# Altium schematic sheet Main.SchDoc
size A; SheetNumber: 1; SheetTotal: 1
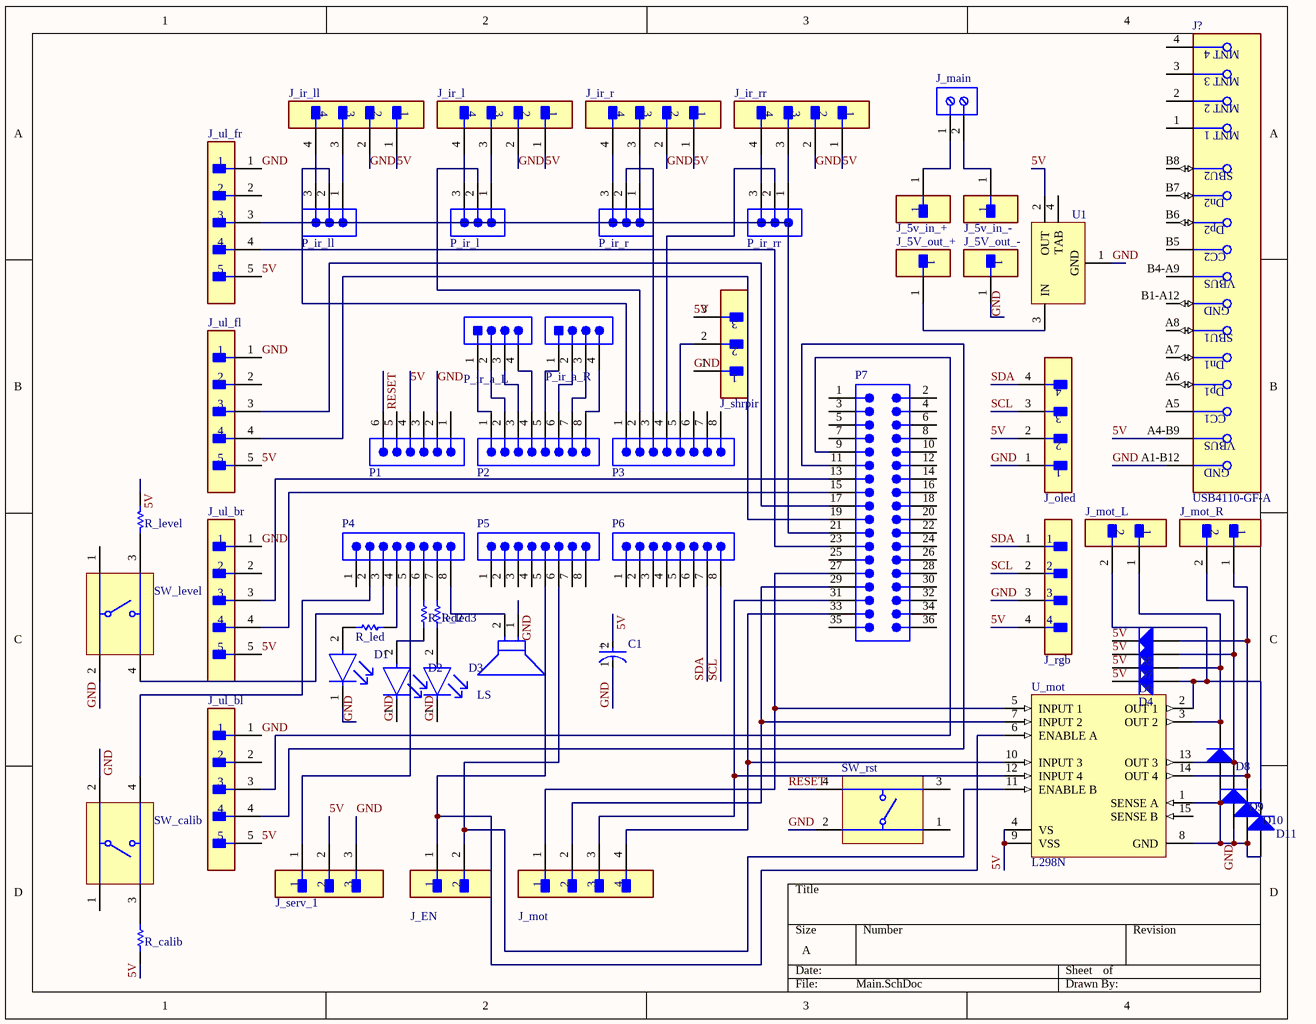
[diagram p0: Main.SchDoc]

## Parts
C1  EEEFT1H221AP  [FP-FTF-MFG]  (value not drawn)
D1  HSMG-C150  [FP-HSMG-C150-MFG]  (value not drawn)
D2  HSMG-C150  [FP-HSMG-C150-MFG]  (value not drawn)
D3  HSMG-C150  [FP-HSMG-C150-MFG]  (value not drawn)
D4  1N4148W-7-F  [DIOD-SOD123-2_V]  (value not drawn)
D5  1N4148W-7-F  [DIOD-SOD123-2_V]  (value not drawn)
D6  1N4148W-7-F  [DIOD-SOD123-2_V]  (value not drawn)
D7  1N4148W-7-F  [DIOD-SOD123-2_V]  (value not drawn)
D8  1N4148W-7-F  [DIOD-SOD123-2_V]  (value not drawn)
D9  1N4148W-7-F  [DIOD-SOD123-2_V]  (value not drawn)
D10  1N4148W-7-F  [DIOD-SOD123-2_V]  (value not drawn)
D11  1N4148W-7-F  [DIOD-SOD123-2_V]  (value not drawn)
J?  USB4110-GF-A  [FP-USB4110-GF-A-MFG]
J_5v_in_+  PBC01SAAN  [FP-PBC01SAAN-MFG]  (value not drawn)
J_5v_in_-  PBC01SAAN  [FP-PBC01SAAN-MFG]  (value not drawn)
J_5V_out_+  PBC01SAAN  [FP-PBC01SAAN-MFG]  (value not drawn)
J_5V_out_-  PBC01SAAN  [FP-PBC01SAAN-MFG]  (value not drawn)
J_EN  B2B-XH-A(LF)(SN)  [FP-B2B-XH-A_LF_SN-MFG]  (value not drawn)
J_ir_l  B4B-XH-A(LF)(SN)  [FP-B4B-XH-A_LF_SN-MFG]  (value not drawn)
J_ir_ll  B4B-XH-A(LF)(SN)  [FP-B4B-XH-A_LF_SN-MFG]  (value not drawn)
J_ir_r  B4B-XH-A(LF)(SN)  [FP-B4B-XH-A_LF_SN-MFG]  (value not drawn)
J_ir_rr  B4B-XH-A(LF)(SN)  [FP-B4B-XH-A_LF_SN-MFG]  (value not drawn)
J_main  1714955  [PHOE-1714955_V]  (value not drawn)
J_mot  B4B-XH-A(LF)(SN)  [FP-B4B-XH-A_LF_SN-MFG]  (value not drawn)
J_mot_L  B2B-XH-A(LF)(SN)  [FP-B2B-XH-A_LF_SN-MFG]  (value not drawn)
J_mot_R  B2B-XH-A(LF)(SN)  [FP-B2B-XH-A_LF_SN-MFG]  (value not drawn)
J_oled  B4B-XH-A(LF)(SN)  [FP-B4B-XH-A_LF_SN-MFG]  (value not drawn)
J_rgb  B4B-XH-A(LF)(SN)  [FP-B4B-XH-A_LF_SN-MFG]  (value not drawn)
J_serv_1  B3B-XH-A(LF)(SN)  [FP-B3B-XH-A_LF_SN-MFG]  (value not drawn)
J_shrpir  B3B-XH-A(LF)(SN)  [FP-B3B-XH-A_LF_SN-MFG]  (value not drawn)
J_ul_bl  B5B-EH-A(LF)(SN)  [FP-B5B-EH-A_LF_SN-MFG]  (value not drawn)
J_ul_br  B5B-EH-A(LF)(SN)  [FP-B5B-EH-A_LF_SN-MFG]  (value not drawn)
J_ul_fl  B5B-EH-A(LF)(SN)  [FP-B5B-EH-A_LF_SN-MFG]  (value not drawn)
J_ul_fr  B5B-EH-A(LF)(SN)  [FP-B5B-EH-A_LF_SN-MFG]  (value not drawn)
LS  SD1209T5-A1  [FP-SD1209-MFG]  (value not drawn)
P1  61300611121  [61300611121]  (value not drawn)
P2  61300811121  [61300811121]  (value not drawn)
P3  61300811121  [61300811121]  (value not drawn)
P4  61300811121  [61300811121]  (value not drawn)
P5  61300811121  [61300811121]  (value not drawn)
P6  61300811121  [61300811121]  (value not drawn)
P7  61303621121  [61303621121]  (value not drawn)
P_ir_a_L  S4B-XH-A(LF)(SN)  [JST-S4B-XH-A(LF)(SN)_V]  (value not drawn)
P_ir_a_R  S4B-XH-A(LF)(SN)  [JST-S4B-XH-A(LF)(SN)_V]  (value not drawn)
P_ir_l  61900311121  [61900311121]  (value not drawn)
P_ir_ll  61900311121  [61900311121]  (value not drawn)
P_ir_r  61900311121  [61900311121]  (value not drawn)
P_ir_rr  61900311121  [61900311121]  (value not drawn)
R_calib  ERJ-8GEY0R00V  [RESC3216X70X50NL05T20]  (value not drawn)
R_led  ERJ-8GEY0R00V  [RESC3216X70X50NL05T20]  (value not drawn)
R_led2  ERJ-8GEY0R00V  [RESC3216X70X50NL05T20]  (value not drawn)
R_led3  ERJ-8GEY0R00V  [RESC3216X70X50NL05T20]  (value not drawn)
R_level  ERJ-8GEY0R00V  [RESC3216X70X50NL05T20]  (value not drawn)
SW_calib  FSM4JSMA  [TECO-FSM4JSMA_V]  (value not drawn)
SW_level  FSM4JSMA  [TECO-FSM4JSMA_V]  (value not drawn)
SW_rst  FSM4JSMA  [TECO-FSM4JSMA_V]  (value not drawn)
U1  LM1117MPX-3.3/NOPB  [DCY0004A_L]  (value not drawn)
U_mot  L298N  [STM-FM-15]

## Nets
5V: C1.2(A) D4.2(K) D5.2(K) D6.2(K) D7.2(K) J?.A4-B9(VBUS) J_ir_l.1 J_ir_ll.1 J_ir_r.1 J_ir_rr.1 J_oled.2 J_rgb.4 J_serv_1.2 J_shrpir.3 J_ul_bl.5 J_ul_br.5 J_ul_fl.5 J_ul_fr.5 P1.4 R_calib.1 R_level.1 U1.2(OUT) U_mot.4(VS) U_mot.9(VSS)
GND: C1.1(C) D1.1(C) D2.1(C) D3.1(C) D8.1(A) D9.1(A) D10.1(A) D11.1(A) J?.A1-B12(GND) J_5V_out_-.1 J_ir_l.2 J_ir_ll.2 J_ir_r.2 J_ir_rr.2 J_oled.1 J_rgb.3 J_serv_1.3 J_shrpir.1 J_ul_bl.1 J_ul_br.1 J_ul_fl.1 J_ul_fr.1 LS.1(C) P1.2 SW_calib.2 SW_level.2 SW_rst.2 U1.1(GND) U_mot.1(SENSE_A) U_mot.8(GND)
RESET: P1.6 SW_rst.4
SCL: J_oled.3 J_rgb.2 P6.8
SDA: J_oled.4 J_rgb.1 P6.7
NetD1_2: D1.2(A) R_led.2
NetD2_2: D2.2(A) R_led2.2
NetD3_2: D3.2(A) R_led3.2
NetD4_1: D4.1(A) D11.2(K) J_mot_L.2 U_mot.2(OUT_1)
NetD5_1: D5.1(A) D10.2(K) J_mot_R.1 U_mot.14(OUT_4)
NetD6_1: D6.1(A) D8.2(K) J_mot_L.1 U_mot.3(OUT_2)
NetD7_1: D7.1(A) D9.2(K) J_mot_R.2 U_mot.13(OUT_3)
NetJ_5v_in_+_1: J_5v_in_+.1 J_main.1
NetJ_5v_in_-_1: J_5v_in_-.1 J_main.2
NetJ_5V_out_+_1: J_5V_out_+.1 U1.3(IN)
NetJ_EN_1: J_EN.1 P5.5 U_mot.6(ENABLE_A)
NetJ_EN_2: J_EN.2 P5.6 U_mot.11(ENABLE_B)
NetJ_ir_l_3: J_ir_l.3 P_ir_l.1
NetJ_ir_l_4: J_ir_l.4 P_ir_l.3
NetJ_ir_ll_3: J_ir_ll.3 P_ir_ll.1
NetJ_ir_ll_4: J_ir_ll.4 P_ir_ll.3
NetJ_ir_r_3: J_ir_r.3 P_ir_r.1
NetJ_ir_r_4: J_ir_r.4 P_ir_r.3
NetJ_ir_rr_3: J_ir_rr.3 P_ir_rr.1
NetJ_ir_rr_4: J_ir_rr.4 P_ir_rr.3
NetJ_mot_1: J_mot.1 P7.27 U_mot.5(INPUT_1)
NetJ_mot_2: J_mot.2 P7.29 U_mot.7(INPUT_2)
NetJ_mot_3: J_mot.3 P7.31 U_mot.12(INPUT_4)
NetJ_mot_4: J_mot.4 P7.33 U_mot.10(INPUT_3)
NetJ_serv_1_1: J_serv_1.1 P4.5
NetJ_shrpir_2: J_shrpir.2 P3.5
NetJ_ul_bl_3: J_ul_bl.3 P7.9
NetJ_ul_bl_4: J_ul_bl.4 P7.11
NetJ_ul_br_3: J_ul_br.3 P7.13
NetJ_ul_br_4: J_ul_br.4 P7.15
NetJ_ul_fl_3: J_ul_fl.3 P7.17
NetJ_ul_fl_4: J_ul_fl.4 P7.19
NetJ_ul_fr_3: J_ul_fr.3 P7.21
NetJ_ul_fr_4: J_ul_fr.4 P7.23
NetLS_2: LS.2(A) P4.8
NetP2_1: P2.1 P_ir_a_L.1
NetP2_2: P2.2 P_ir_a_L.2
NetP2_3: P2.3 P_ir_a_L.3
NetP2_4: P2.4 P_ir_a_L.4
NetP2_5: P2.5 P_ir_a_R.1
NetP2_6: P2.6 P_ir_a_R.2
NetP2_7: P2.7 P_ir_a_R.3
NetP2_8: P2.8 P_ir_a_R.4
NetP3_1: P3.1 P_ir_ll.2
NetP3_2: P3.2 P_ir_l.2
NetP3_3: P3.3 P_ir_r.2
NetP3_4: P3.4 P_ir_rr.2
NetP4_2: P4.2 SW_calib.4
NetP4_3: P4.3 SW_level.4
NetP4_4: P4.4 R_led.1
NetP4_6: P4.6 R_led2.1
NetP4_7: P4.7 R_led3.1
NetR_calib_2: R_calib.2 SW_calib.3
NetR_level_2: R_level.2 SW_level.3

Not connected (* = marked no-connect by the designer): J? 1(MNT_1) 2(MNT_2) 3(MNT_3) 4(MNT_4) A5(CC1) A6(Dp1) A7(Dn1) A8(SBU1) B1-A12(GND) B4-A9(VBUS) B5(CC2) B6(Dp2) B7(Dn2) B8(SBU2); J_ul_bl 2; J_ul_br 2; J_ul_fl 2; J_ul_fr 2; P1 1 3 5; P3 6 7 8; P4 1; P5 1 2 3 4 7 8; P6 1 2 3 4 5 6; P7 1 2 3 4 5 6 7 8 10 12 14 16 18 20 22 24 25 26 28 30 32 34 35 36; SW_calib 1; SW_level 1; SW_rst 1 3; U1 4(TAB); U_mot 15(SENSE_B)

## Notes on the sheet
- (in symbol CMP-05427-000092-1) +

## Library data of the parts
C1 = CMP-05427-000092-1: CAP ALUM 220UF 20% 50V SMD; Ripple Current (AC): 670mA; Dielectric Material: Aluminium; Life (Hours): 2000Hour; Leakage Current: 110uA; Lead Diameter: 0.9mm; ESR (Equivalent Series Resistance): 180mR; REACH SVHC: No SVHC; Voltage Rating (DC): 50V; Radiation Hardening: No; Capacitance: 220uF; Length: 10.2mm; Construction: Cylindrical; Case/Package: Radial; Series: FT; Lead Free: Lead Free; Voltage Rating: 50V; Tolerance: 20%; Contact Plating: Tin; Number of Pins: 2; Height - Seated (Max): 0.413inch; RoHS Compliant: Yes; Diameter: 8mm; Ripple Current: 670mA; Lead Pitch: 3.1mm; Termination: SMD/SMT; Mount: Surface Mount; Min Operating Temperature: -55°C; Max Operating Temperature: 105°C; Voltage: 50V; Height: 10.2mm; Package Quantity: 500; Packaging: Tape and Reel
D1-D3 = CMP-2000-05061-2: LED GREEN DIFFUSED 1206 SMD; Manufacturer: Broadcom; Led Orientation: Top View; Max Junction Temp: +95°C; Peak Emmision Wavelength: 570nm; Viewing Angle: 170°; Wavelength: 572nm; Reverse Voltage: 5V; Luminous Intensity: 15mcd; Forward Voltage: 2.2V; Power Dissipation: 65mW; Forward Current: 20mA; ComponentLink2Description: Datasheet; Lead Free: Yes; Temperature Range Low: -40°C; Package: HSMG-C150; Digikey Description: LED GREEN DIFFUSED 1206 SMD; Mouser Description: LED Uni-Color Green 570nm 2-Pin Chip LED T/R; Manufacturer Part Number: HSMG-C150; Temperature Range High: +85°C; Device Class L1: Optoelectronics; Colour: Green; Category: Diode; Device Class L3: unset; RoHS: TRUE; Height: 1.2mm; ComponentLink2URL: https://docs.broadcom.com/docs/AV02-0551EN; Device Class L2: LEDs; Automotive: No; Ipc Land Pattern Name: DIOCP320160X55; Octopart: https://octopart.com/hsmg-c150-broadcom-71131304; Temperature: -40°C to +85°C
D4-D11 = CMP-2000-04932-2: Fast Switching Diode, 100 V, 0.15 A, -65 to 150 degC, 2-Pin?SOD123, RoHS, Tape and Reel; Recovery Time: 4ns; Brand: DiodesIncorporated; Unit Weight: 0.000353oz; Max Surge Current: 2A; Peak Reverse Voltage: 100V; Ir - Reverse Current: 1uA; Vf - Forward Voltage: 1.25V; Configuration: Single; If - Forward Current: 0.15A; Product Category: Diodes-GeneralPurpose,Power,Switching; Operating Temperature Range: -65Cto+150C; Packaging: Reel; Manufacturer URL: http://www.diodes.com/; Maximum Operating Temperature: +150C; Height: 1.25mm; Minimum Operating Temperature: -65C; Product: SwitchingDiodes; Package URL: http://www.diodes.com/datasheets/ds18004.pdf; Type: SwitchingDiode; Package Reference: SOD123-2; Width: 1.7mm; Datasheet URL: http://www.farnell.com/datasheets/1915529.pdf; Datasheet Version: Rev. 24-2, 10/2013; Series: 1N4148; Factory Pack Quantity: 3000; Length: 2.85mm; RoHS: True; Manufacturer: DiodesIncorporated; Mounting Style: SMD/SMT; Package / Case: SOD-123
J? = CMP-245163-000002-1: CONN USB 2.0 TYPE-C R/A SMT; Manufacturer: GCT; Conn Orientation: Right Angle; Usb Standard: USB 2.0; Voltage Rating: 20V; Current Rating: 3/4.25/1.25/0.25A; Description: USB - C (Type - C) USB 2.0 Receptacle Connector 24 (16+8 Dummy) Position Surface Mount, Right Angle; Through Hole; Number Of Contacts: 16; Is Female: yes; Shielding: true; Standoff Height: 0.1mm; Octopart: https://octopart.com/usb4110-gf-a-gct-103941985; Temperature: -40°C to +85°C; RoHS: TRUE; Automotive: No; Contact Material: Gold,Nickel; Device Class L1: Connectors; Device Class L2: USB Connectors; Package: 0; Lead Free: Yes; ComponentLink2URL: https://gct.co/files/drawings/usb4110.pdf; Temperature Range High: +85°C; Temperature Range Low: -40°C; Height: 3.46mm; Manufacturer Part Number: USB4110-GF-A; ComponentLink2Description: Datasheet; Device Class L3: unset; Digikey Description: CONN USB 2.0 TYPE-C R/A SMT; Category: Conn
J_5v_in_+ J_5v_in_- J_5V_out_+ J_5V_out_- = CMP-25680-000032-1: CONN HEADER VERT 1POS; Number of Positions: 1; Connector Type: Male Pin; Gender: Male; Pitch: 2.54mm; Contact Material: Bronze; Mount: Through Hole; Length: 2.54mm; Height: 2.54mm; Lead Free: Lead Free; Number of Rows: 1; Contact Plating: Gold; Number of Contacts: 1; Housing Material: Plastic; Termination: Solder; Package Quantity: 1; Packaging: Bulk; Color: Black; Contact Mating Length: 0.23inch; Housing Color: Black; Width: 2.54mm
J_EN J_mot_L J_mot_R = CMP-2000-05888-3: CONN HEADER VERT 2POS 2.5MM; Current Rating: 3A; Voltage Rating: 250V; Number of Contacts: 2; Contact Resistance: 20mR; Wire/Cable Gauge: 22AWG; Insulation Resistance: 1GR; Connector Type: Male Pin; Packaging: Bulk; Contact Material: Brass; Lead Free: Lead Free; Orientation: Straight; Contact Plating: Tin; Max Current Rating: 3A; Termination: Solder; Fastening Type: Detent; Depth: 5.75mm; Housing Material: Polyamide; REACH SVHC: No SVHC; Series: XH; Voltage Rating (AC): 250V; Number of Positions: 2; Color: Natural; Contact Type: Male Pin; Max Voltage Rating (DC): 250V; Pitch: 2.5mm; Lead Pitch: 2.5mm; Mount: Through Hole; Max Operating Temperature: 85°C; Length: 7.4mm; Max Voltage Rating (AC): 250V; Min Operating Temperature: -25°C; Number of Rows: 1; Housing Color: White
J_ir_l J_ir_ll J_ir_r J_ir_rr J_mot J_oled J_rgb = CMP-17439-000250-1: CONN HEADER VERT 4POS 2.5MM; Number of Contacts: 4; Contact Resistance: 20mR; Voltage Rating: 250V; Max Current Rating: 3A; Gender: Male; Wire/Cable Gauge: 22AWG; Mated Stacking Heights: 9.8mm; Insulation Resistance: 1GR; Orientation: Straight; Contact Type: Male Pin; Contact Finish - Mating: TIN; Series: XH; Max Voltage Rating (AC): 250V; Lead Pitch: 2.5mm; Contact Shape: Square; Insulation Color: Natural; Termination: Solder; Lead Free: Lead Free; Voltage Rating (AC): 250V; Number of Rows: 1; Flammability Rating: UL94 V-0; Number of Positions: 4; Max Operating Temperature: 85°C; Package Quantity: 500; Mount: Through Hole; REACH SVHC: No SVHC; Connector Type: Header; Insulation Material: Nylon; Fastening Type: Detent; Min Operating Temperature: -25°C; Housing Color: White; Packaging: Bulk; Contact Plating: Tin; Contact Material: Brass; Max Voltage Rating (DC): 250V; Housing Material: Polyamide; Color: Natural; Material: Polyamide; Pitch: 2.5mm; Depth: 5.75mm; Current Rating: 3A; Length: 12.4mm
J_main = CMP-2000-05797-1: PC Terminal Block, Pitch 6.35 mm, 1 x 2 Position, Height 21.5 mm, Tail Lenght 5.1 mm, RoHS, Bulk; Manufacturer: Phoenix Contact; Package Description: PC Terminal Block, Pitch 6.35 mm, 1 x 2 Position, Height 21.5 mm, Tail Lenght 5.1 mm; Datasheet URL: http://media.digikey.com/pdf/Data%20Sheets/Phoenix%20Contact%20PDFs/1714955.pdf; Package Reference: 1714955; Manufacturer URL: http://www.phoenixcontact.com/; Datasheet Version: 02/2010; Mounting Technology: ThroughHole
J_serv_1 J_shrpir = CMP-17439-000014-3: CONN HEADER VERT 3POS 2.5MM; Max Voltage Rating (DC): 250V; Number of Positions: 3; Current Rating: 3A; Gender: Male; Wire/Cable Gauge: 22AWG; Contact Resistance: 20mR; Insulation Resistance: 1GR; Insulation Material: Nylon; Contact Plating: Tin; Depth: 5.75mm; Contact Type: Male Pin; Max Operating Temperature: 85°C; Insulation Color: Natural; Voltage Rating (AC): 250V; Color: Natural; Connector Type: Header; Orientation: Straight; Fastening Type: Detent; Housing Color: White; Min Operating Temperature: -25°C; Termination: Solder; Voltage Rating: 250V; Series: XH; Pitch: 2.5mm; Contact Shape: Square; Number of Rows: 1; Lead Free: Lead Free; Packaging: Bulk; Mount: Through Hole; Flammability Rating: UL94 V-0; Max Voltage Rating (AC): 250V; REACH SVHC: No SVHC; Housing Material: Polyamide; Contact Material: Brass; Lead Pitch: 2.5mm; Contact Finish - Mating: TIN; Length: 9.9mm; Max Current Rating: 3A; Number of Contacts: 3
J_ul_bl J_ul_br J_ul_fl J_ul_fr = CMP-17439-000382-1: CONN HEADER VERT 5POS 2.5MM; Number of Contacts: 5; Mated Stacking Heights: 8.1mm; Current Rating: 3A; Gender: Male; Voltage Rating: 250V; Lead Free: Lead Free; Fastening Type: Friction; Contact Type: Male Pin; Insulation Color: Natural; Insulation Material: Nylon; Contact Material: Brass; Contact Mating Length: 0.13inch; Pitch: 2.5mm; Number of Positions: 5; Number of Rows: 1; Connector Type: Header; Color: Natural; Contact Shape: Square; Flammability Rating: UL94 V-0; Orientation: Straight; Packaging: Bulk; Mount: Through Hole; Contact Finish - Mating: TIN; Contact Plating: Tin; Series: EH; Termination: Solder; Housing Color: White
LS = CMP-08413-000009-1: AUDIO MAGNETIC XDCR 3-6V TH; Max Supply Current: 60mA; Number of Terminals/Pins: 2; Frequency: 2.048kHz; Washable: No; Operating Supply Voltage: 5V; Self Resonant Frequency: 2.05kHz; Min Operating Temperature: -40°C; Operating Supply Current: 60mA; Diameter: 12mm; Package Quantity: 100; Max Operating Temperature: 85°C; Sensing Method: Magnetic; Series: SD; Current Rating: 60mA; Lead Free: Lead Free; Height: 9mm; Packaging: Tray; Termination: PC Pins; Number of Pins: 2; Voltage Rating (DC): 5V; Mount: Through Hole
P1 = CMP-1502-01070-2: NexarPartId: 20084590; Operating Supply Voltage: 250V; Current Rating: 3A; Number of Contacts: 6; Gender: Male; Connector Type: Male Pin; Pitch: 2.54mm; Contact Resistance: 20mΩ; Lead Free: Lead Free; REACH SVHC: Unknown; Number of Rows: 1; Color: Black; Min Operating Temperature: -40°C; Contact Material: Copper; Lead Pitch: 2.54mm; Contact Plating: Gold; Number of Pins: 6; Height: 8.89mm; Orientation: Vertical; Termination: Through Hole; Mount: Through Hole; RoHS: Compliant; Contact Gender: Male; Contact Mating Length: 5.9944mm; Voltage Rating: 250V; Number of Positions: 6; Housing Material: PBT; Packaging: Bulk; Max Operating Temperature: 105°C
P2-P6 = CMP-1502-01076-2: NexarPartId: 32855533; Current Rating: 3A; Connector Type: Male Pin; Voltage Rating: 250V; Number of Contacts: 8; Pitch: 2.54mm; Contact Resistance: 20mΩ; Gender: Male; REACH SVHC: Unknown; Number of Rows: 1; Mount: Through Hole; Termination: Solder; Number of Pins: 8; Number of Positions: 8; Height: 8.54mm; Contact Mating Length: 5.9944mm; Orientation: Vertical; Operating Supply Voltage: 250V; Min Operating Temperature: -40°C; Max Operating Temperature: 105°C; Packaging: Bulk; Color: Black; Lead Pitch: 2.54mm; RoHS: Compliant; Contact Material: Copper; Contact Plating: Gold
P7 = CMP-1502-01131-2: NexarPartId: 32855576; Operating Supply Voltage: 250V; Pitch: 2.54mm; Contact Resistance: 20mΩ; Number of Contacts: 36; Connector Type: Male Pin; Current Rating: 3A; Gender: Male; Contact Plating: Gold; Orientation: Vertical; Packaging: Bulk; Termination: Solder; Lead Pitch: 2.54mm; Row Spacing: 2.54mm; RoHS: Compliant; Mount: Through Hole; REACH SVHC: Unknown; Number of Positions: 36; Number of Pins: 36; Contact Mating Length: 5.9944mm; Color: Black; Contact Material: Copper; Number of Rows: 2
P_ir_a_L P_ir_a_R = CMP-1755-00007-1: Male Header, Pitch 2.5 mm, 1 x 4 Position, Height 6.1 mm, Tail Length 3.4 mm, -25 to 85 degC, RoHS, Bulk; PackageReference: S4B-XH-A(LF)(SN); ComponentLink1Description: Manufacturer URL; DatasheetVersion: May-16; ComponentLink2Description: Datasheet; ComponentLink2URL: http://www.jst-mfg.com/product/pdf/eng/eXH.pdf; ComponentLink1URL: http://www.jst.com/home2.html; PackageDescription: Male Header, Pitch 2.5 mm, 1 x 4 Position, Height 6.1 mm, Tail Length 3.4 mm
P_ir_l P_ir_ll P_ir_r P_ir_rr = CMP-1502-00585-2: NexarPartId: 18818222; Current Rating: 3A; Voltage Rating: 250V; Number of Positions: 3; Insulation Resistance: 1GΩ; Gender: Male; Pitch: 2.54mm; Connector Type: Male Pin; Contact Resistance: 20mΩ; Termination: Through Hole; Width: 7.66mm; Contact Plating: Tin; Orientation: Vertical; Mount: Through Hole; Contact Gender: Male; Max Operating Temperature: 105°C; Length: 7.62mm; Number of Rows: 1; Height: 12.5mm; Lead Pitch: 2.54mm; Housing Material: Nylon; Color: Beige; Contact Material: Copper; Fastening Type: Friction; Min Operating Temperature: -40°C; Number of Contacts: 3; Number of Pins: 3; Flammability Rating: UL94 V-0; Contact Mating Length: 7.493mm; RoHS: Compliant; REACH SVHC: Unknown; Packaging: Bulk; Operating Supply Voltage: 250V
R_calib R_led R_led2 R_led3 R_level = CMP-2003-00541-1: Manufacturer: Panasonic; Part Number: ERJ-8GEY0R00V
SW_calib SW_level SW_rst = CMP-2000-05602-2: Swicth, SPST, 24 V, -35 to 85 degC, 4-Pin SMD, RoHS, Tape and Reel; Manufacturer: TE Connectivity; Switch Travel: 0.25mm; Mechanical Life: 100000Cycles; Contact Current Rating: 50mA; Operating Force: 1.57N; Actuator Material: Polyamide; Contact Resistance: 100mOhm; Voltage Rating: 24V; Illumination Type: Illuminated; Actuator Length: 0.055inch; Max Voltage Rating (DC): 12V; Case\/Package: SMD/SMT; Orientation: Straight; Datasheet URL: http://www.te.com/commerce/DocumentDelivery/DDEController?Action=showdoc&DocId=Customer+Drawing%7F2-1437565-7%7FV%7Fpdf%7FEnglish%7FENG_CD_2-1437565-7_V.pdf%7F4-1437565-2; Min Operating Temperature: -35degC; Packaging: LoosePiece; Termination: GullWing; Throw Configuration: SPST; Package Description: 4-Pin Surface Mount Device, Body 6 x 6 mm, Pitch 4.5 mm; Mounting Technology: SurfaceMount; Contact Plating: Silver; Datasheet Version: Rev. V, 02/2015; RoHSCompliant: true; Max Operating Temperature: 85degC; Length: 6mm; Voltage Rating (DC): 24V; Electrical Life: 100000Cycles; Current Rating: 50mA; Package Quantity: 750; Mount: SurfaceMount; Package Reference: FSM4JSMA; Manufacturer URL: http://www.te.com/; Width: 6mm; REACH SVHC: Unknown; Contact Material: CopperAlloy
U1 = CMP-0062-01639-4: 800mA Low-Dropout Linear Regulator, 4-pin SOT-223, Pb-Free; Manufacturer: Texas Instruments; High-Reliability: Y; PowerWise: N; PackageTopMarking: XYTT*N05A; CompType: LDO IC; ComponentLink1URL: http://www.ti.com/general/docs/lit/getliterature.tsp?genericPartNumber=LM1117-N&fileType=pdf; PartNumber: LM1117MPX-3.3/NOPB; ComponentLink1Description: Datasheet URL; PinCount: 4; Code_JEDEC: TO-261-AA; PackageDescription: Molded SOT-223, 6.50 x 3.56 x 1.6mm Body, 4 Lead, 2.3mm Pitch; PackageReference: DCY0004A; RoHS: Y; Code_IPC: SOT223-4
U_mot = CMP-2000-06526-1: Dual Full-Bridge Driver, 4.8 to 46 V, -40 to 150 degC, 15-Pin FM (MW 15L), RoHS, Tube; Manufacturer: STMicroelectronics; PartNumber: L298; Output Current: 2A; Supply Voltage Max: 7V; Driver Case Style: Multiwatt; Supply Voltage Min: 4.5V; No. of Pins: 15Pins; SVHC: NoSVHC(17-Dec-2015); Output Voltage: 46V; No. of Outputs: 4Outputs; Motor Type: FullBridge; MSL: -; Package Description: 15-Pin Flange Mount, Body 5 x 19.6 mm, Pitch 1.27 mm; Datasheet Version: 01/2000; Package Reference: FM-15; Mounting Technology: ThroughHole; Packaging: Each; Automotive Qualification Standard: -; Product Range: -; Datasheet URL: https://datasheet.ciiva.com/15109/getdatasheetpartid-50682-15109332.pdf; Operating Temperature Max: 130°C; Operating Temperature Min: -25°C; Manufacturer URL: http://www.st.com/